# EAGLE schematic clock & reset for audio equipment (EAGLE 6.3)
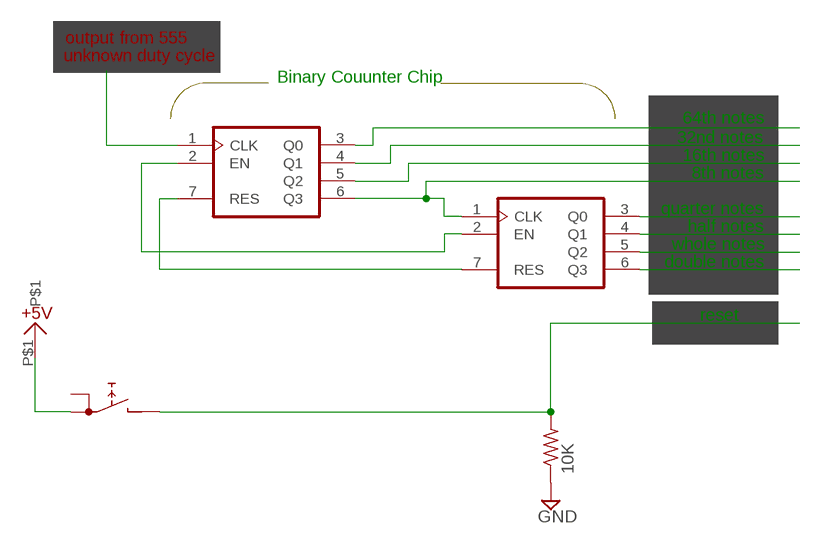
[diagram p0: schematic, sheet 1]

## Parts
IC1  4518N  [DIL16]
IC2  4518N  [DIL16]
R1  10K  R-US_0204/7  [0204/7]
S1  RDT1034  [RDT1034]
U$1  +5V  [+5V]

## Nets
GND: R1.1
N$1: IC1.6(A:Q3) IC2.1(A:CLK)
N$2: IC1.1(A:CLK)
N$3: IC1.2(A:EN) IC2.2(A:EN)
N$4: IC1.7(A:RES) IC2.7(A:RES)
N$5: IC1.3(A:Q0)
N$6: IC1.4(A:Q1)
N$7: IC2.3(A:Q0)
N$8: IC2.4(A:Q1)
N$9: IC2.5(A:Q2)
N$10: IC2.6(A:Q3)
N$11: R1.2 S1.B
N$13: S1.A1 U$1.P$1
N$14: IC1.5(A:Q2)
Unconnected: IC1.9(B:CLK) IC1.10(B:EN) IC1.11(B:Q0) IC1.12(B:Q1) IC1.13(B:Q2) IC1.14(B:Q3) IC1.15(B:RES) IC2.9(B:CLK) IC2.10(B:EN) IC2.11(B:Q0) IC2.12(B:Q1) IC2.13(B:Q2) IC2.14(B:Q3) IC2.15(B:RES) S1.A

## Notes on the sheet
- output from 555
- unknown duty cycle
- Binary Couunter Chip
- 64th notes
- 32nd notes
- 16th notes
- 8th notes
- quarter notes
- half notes
- whole notes
- double notes
- reset

## Power pins joined to a net without a drawn wire
VDD: IC1.16(P:VDD) IC2.16(P:VDD)
VSS: IC1.8(P:VSS) IC2.8(P:VSS)

## Library data of the parts
IC1 IC2 = 45xx:4518: Dual BCD up COUNTER
R1 = resistor:R-US_: RESISTOR, American symbol
S1 = switch:RDT1034: PUSH SWITCH www.radiohm.com
U$1 = 001.My.Stuff:+5V